# EAGLE schematic LautIO (EAGLE 9.6.2)

## Sheet 1 of 7
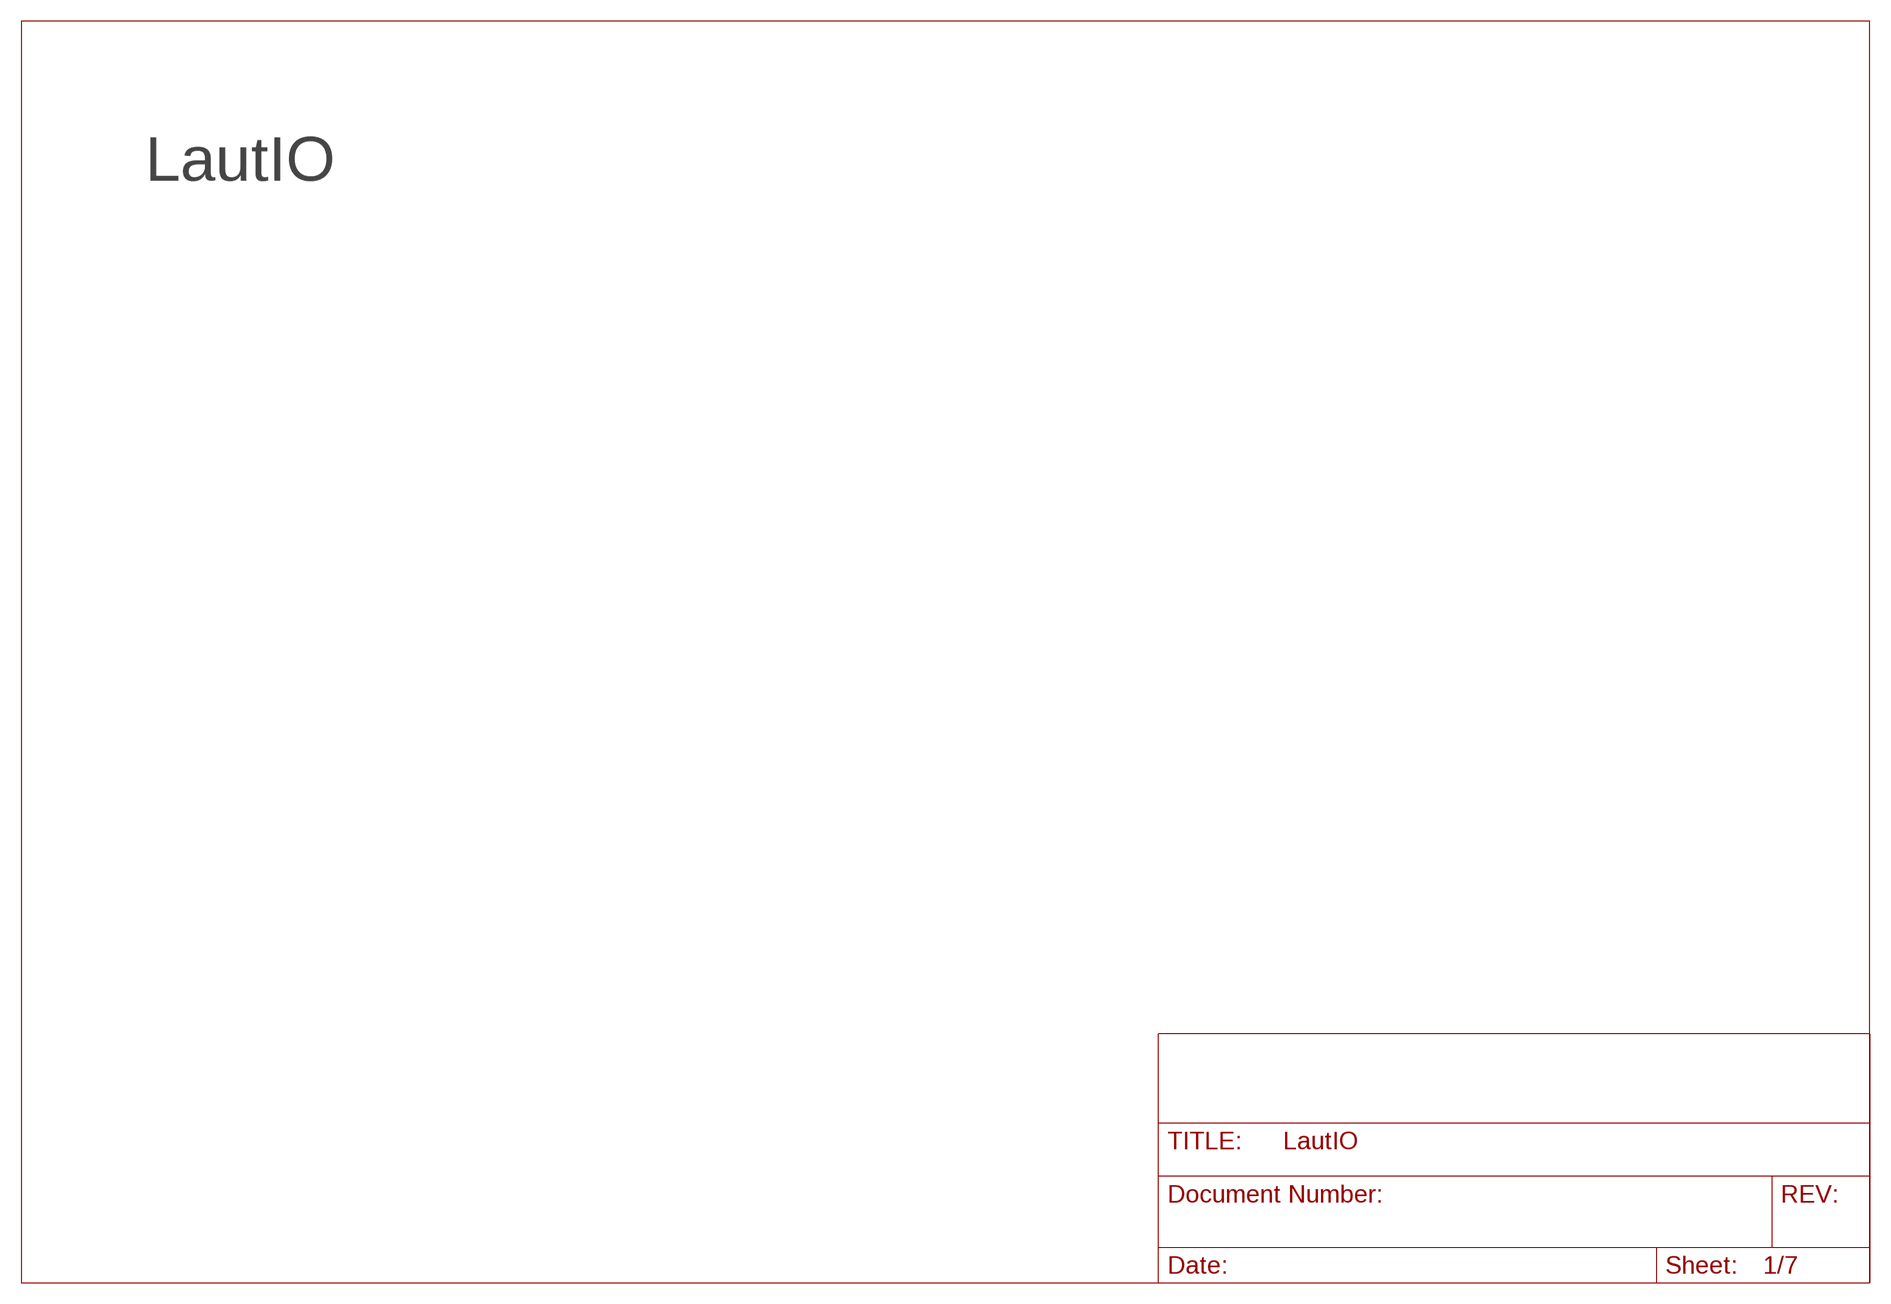
[diagram p0: schematic, sheet 1]

### Notes on the sheet
- LautIO

## Sheet 2 of 7
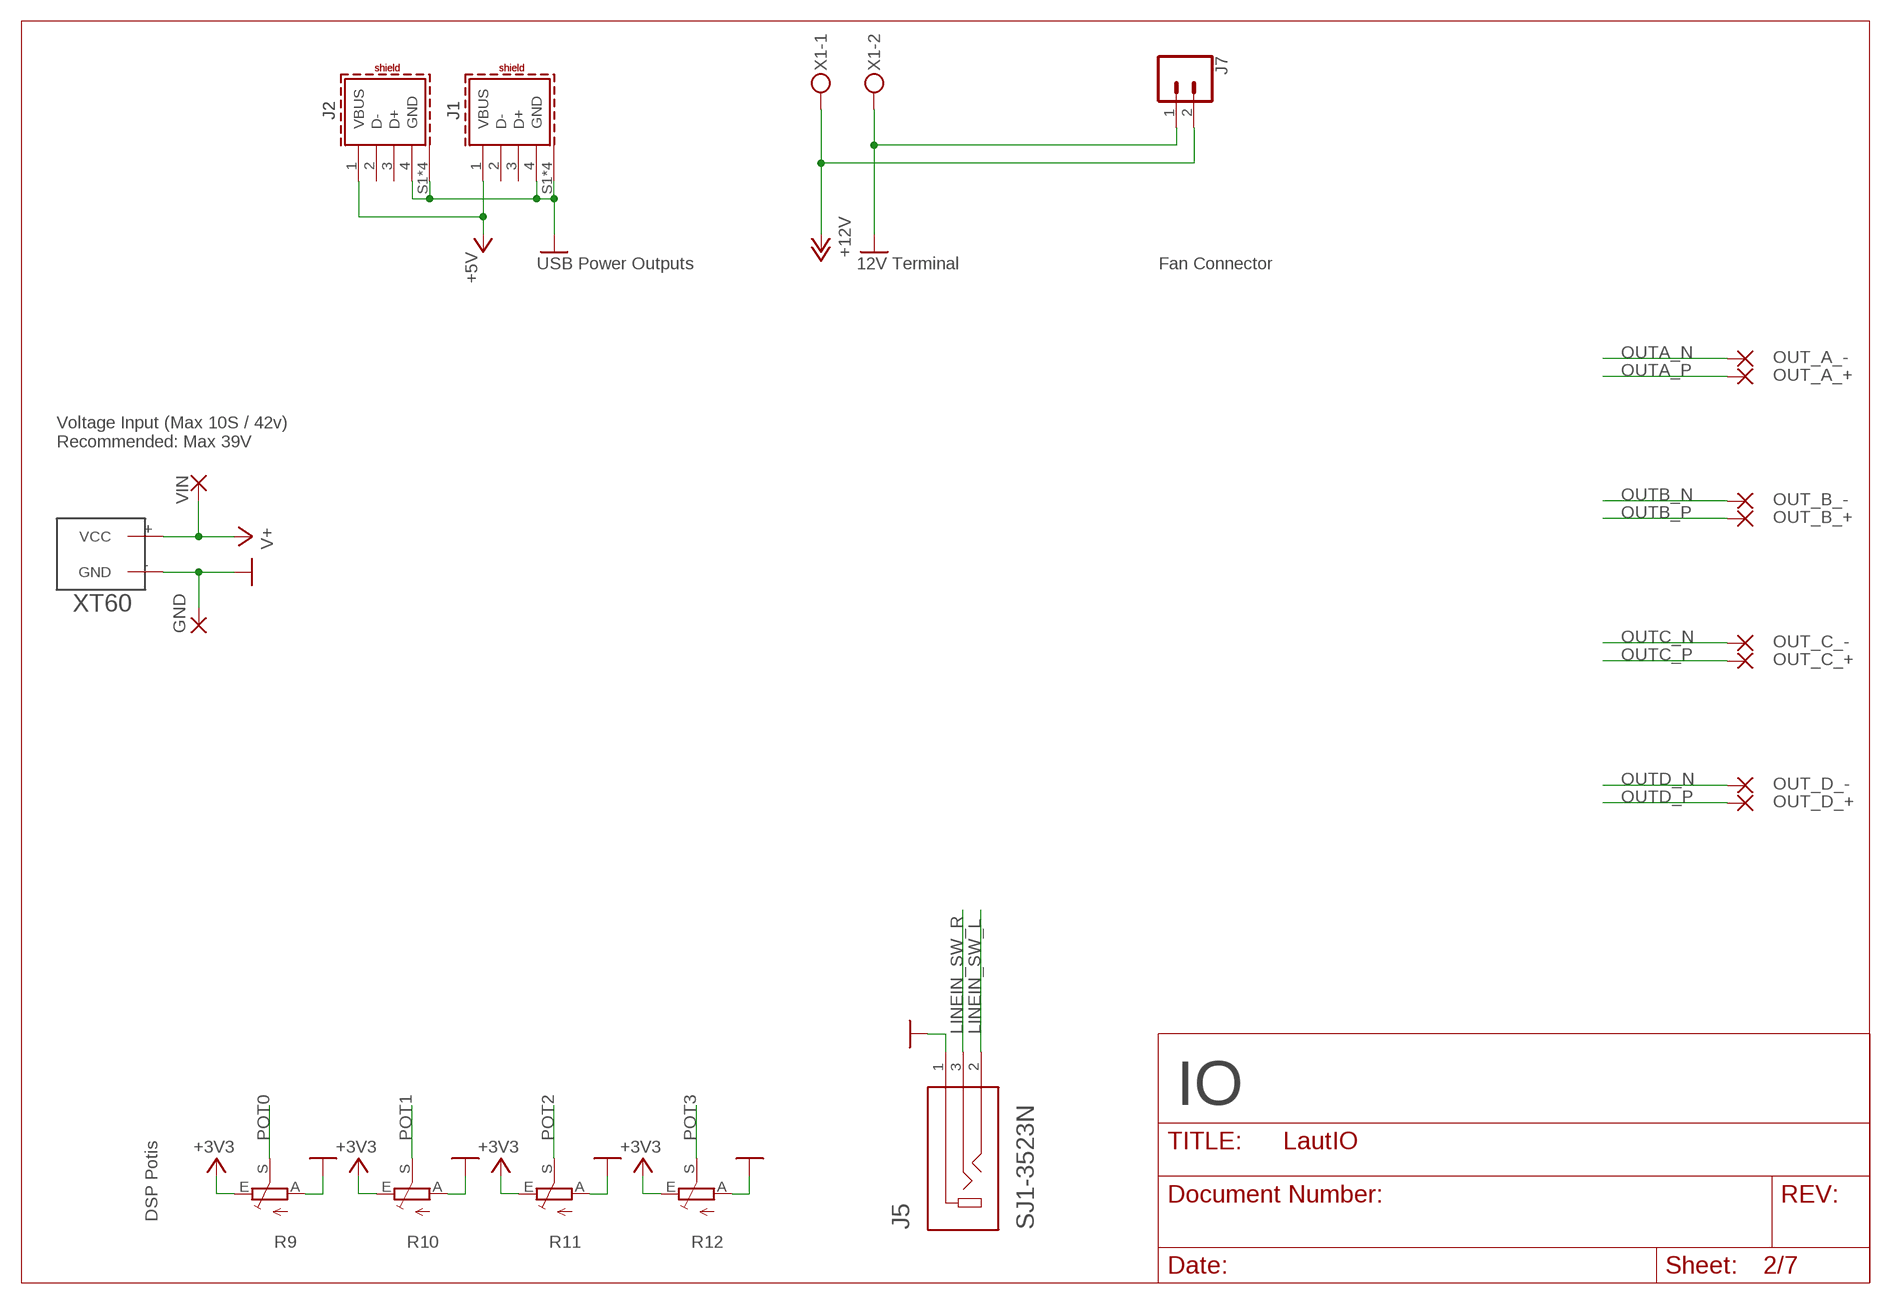
[diagram p1: schematic, sheet 2]

### Parts
GND  SMD5  [SMD2,54-5,08]
J1  614004134726  [614004134726]
J2  614004134726  [614004134726]
J5  SJ1-3523N  [CUI_SJ1-3523N]
J7  CONN_02  [1X02]
OUT_A_+  SMD2  [SMD1,27-2,54]
OUT_A_-  SMD2  [SMD1,27-2,54]
OUT_B_+  SMD2  [SMD1,27-2,54]
OUT_B_-  SMD2  [SMD1,27-2,54]
OUT_C_+  SMD2  [SMD1,27-2,54]
OUT_C_-  SMD2  [SMD1,27-2,54]
OUT_D_+  SMD2  [SMD1,27-2,54]
OUT_D_-  SMD2  [SMD1,27-2,54]
R9  TRIM_EU-CIP20C-6MM  [CIP20C-6MM]
R10  TRIM_EU-CIP20C-6MM  [CIP20C-6MM]
R11  TRIM_EU-CIP20C-6MM  [CIP20C-6MM]
R12  TRIM_EU-CIP20C-6MM  [CIP20C-6MM]
U$1  XT60  [XT60]
VIN  SMD5  [SMD2,54-5,08]
X1  MKDSN1,5/2-5,08  [MKDSN1,5/2-5,08]

### Nets
+3V3: R9.E R10.E R11.E R12.E ; also sheet 3,4,5,6,7
+5V: J1.1(VBUS) J2.1(VBUS) ; also sheet 3,4
+12V: J7.2 X1.1 ; also sheet 3
GND: GND.1(P) J1.4(GND) J1.S1(SHIELD) J1.S2(SHIELD) J1.S3(SHIELD) J1.S4(SHIELD) J2.4(GND) J2.S1(SHIELD) J2.S2(SHIELD) J2.S3(SHIELD) J2.S4(SHIELD) J5.1 J7.1 R9.A R10.A R11.A R12.A U$1.-(GND) X1.2 ; also sheet 3,4,5,6,7
LINEIN_SW_L: J5.2 ; also sheet 5
LINEIN_SW_R: J5.3 ; also sheet 5
OUTA_N: OUT_A_-.1(P) ; also sheet 6
OUTA_P: OUT_A_+.1(P) ; also sheet 6
OUTB_N: OUT_B_-.1(P) ; also sheet 6
OUTB_P: OUT_B_+.1(P) ; also sheet 6
OUTC_N: OUT_C_-.1(P) ; also sheet 7
OUTC_P: OUT_C_+.1(P) ; also sheet 7
OUTD_N: OUT_D_-.1(P) ; also sheet 7
OUTD_P: OUT_D_+.1(P) ; also sheet 7
POT0: R9.S ; also sheet 5
POT1: R10.S ; also sheet 5
POT2: R11.S ; also sheet 5
POT3: R12.S ; also sheet 5
V+: U$1.+(VCC) VIN.1(P) ; also sheet 3,6,7
Unconnected: J1.2(D-) J1.3(D+) J2.2(D-) J2.3(D+)

### Notes on the sheet
- USB Power Outputs | 12V Terminal | Fan Connector
- Voltage Input (Max 10S / 42v)
  Recommended: Max 39V
- IO
- DSP Potis

## Sheet 3 of 7
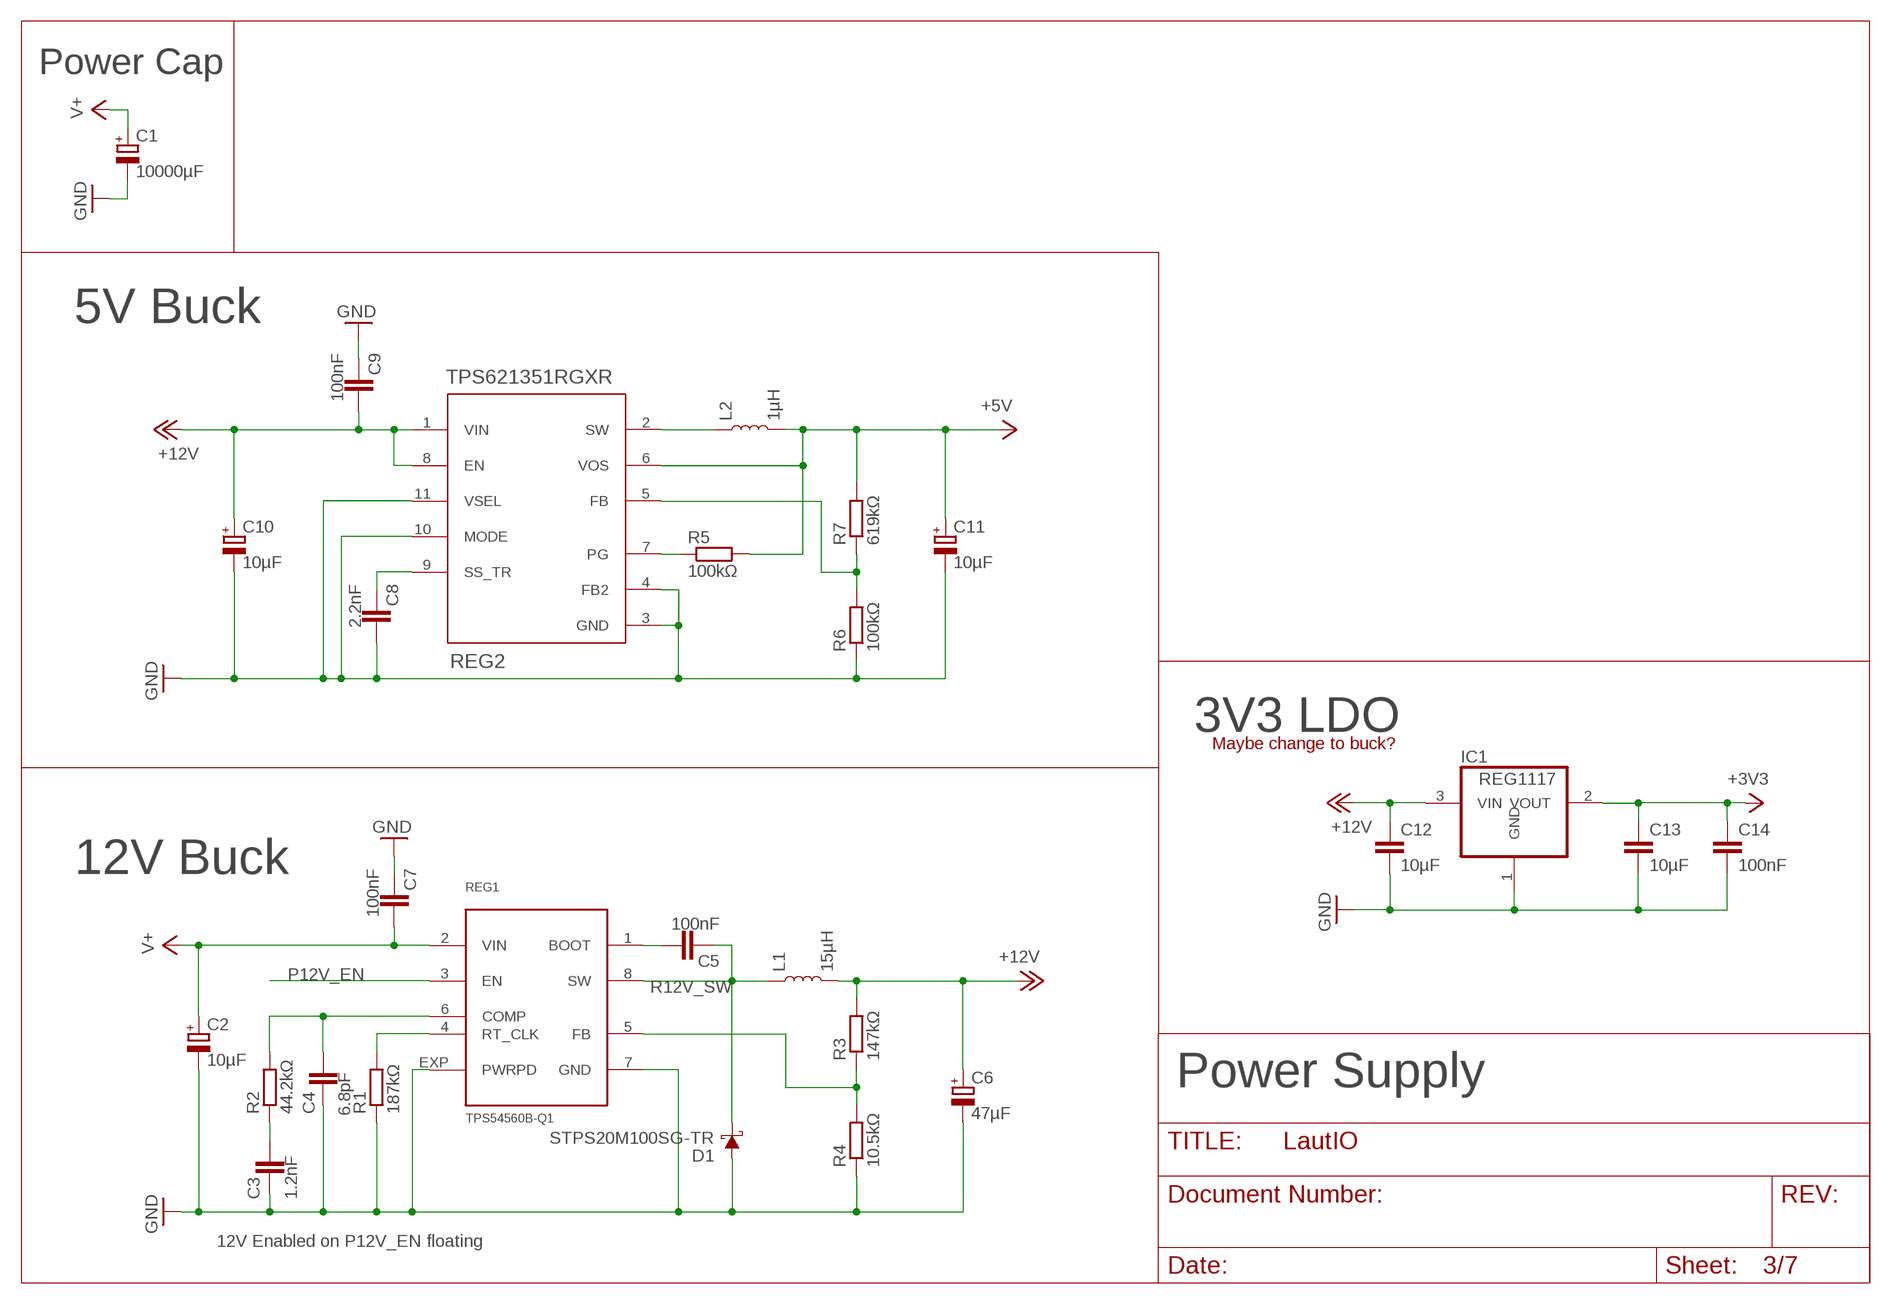
[diagram p2: schematic, sheet 3]

### Parts
C1  10000µF  CPOL-EUE10-35  [EB35D]
C2  10µF  CPOL-EU153CLV-0605  [153CLV-0605]
C3  1.2nF  C-EUC0603  [C0603]
C4  6.8pF  C-EUC0603  [C0603]
C5  100nF  C-EUC0603  [C0603]
C6  47µF  CPOL-EU153CLV-0807  [153CLV-0807]
C7  100nF  C-EUC0603  [C0603]
C8  2.2nF  C-EUC0603  [C0603]
C9  100nF  C-EUC0603  [C0603]
C10  10µF  CPOL-EU153CLV-0605  [153CLV-0605]
C11  10µF  CPOL-EU153CLV-0605  [153CLV-0605]
C12  10µF  C-EUC1206  [C1206]
C13  10µF  C-EUC1206  [C1206]
C14  100nF  C-EUC0603  [C0603]
D1  STPS20M100SG-TR  [TO-263/D2PAK]
IC1  REG1117  [SOT223]
L1  15µH  INDUCTOR-SDR13-27UH  [INDUCTOR_SDR1307]
L2  1µH  4.7μH_SHIELDED_INDUCTORNPIS_LS  [INDUCTOR_4X4MM]
R1  187kΩ  R-EU_R0603  [R0603]
R2  44.2kΩ  R-EU_R0603  [R0603]
R3  147kΩ  R-EU_R0603  [R0603]
R4  10.5kΩ  R-EU_R0603  [R0603]
R5  100kΩ  R-EU_R0603  [R0603]
R6  100kΩ  R-EU_R0603  [R0603]
R7  619kΩ  R-EU_R0603  [R0603]
REG1  TPS54560B-Q1  [HSOP8]
REG2  TPS621351RGXR  [RGX0011A]

### Nets
+3V3: C13.1 C14.1 IC1.2(VOUT) ; also sheet 2,4,5,6,7
+5V: C11.+ L2.P$2 R5.2 R7.2 REG2.6(VOS) ; also sheet 2,4
+12V: C6.+ C9.1 C10.+ C12.1 IC1.3(VIN) L1.P$2 R3.2 REG2.1(VIN) REG2.8(EN) ; also sheet 2
GND: C1.- C2.- C3.2 C4.2 C6.- C7.2 C8.1 C9.2 C10.- C11.- C12.2 C13.2 C14.2 D1.1(A) D1.3(A) IC1.1(GND) R1.1 R4.1 R6.1 REG1.7(GND) REG1.EXP(PWRPD) REG2.3(GND) REG2.4(FB2) REG2.10(MODE) REG2.11(VSEL) ; also sheet 2,4,5,6,7
N$1: R1.2 REG1.4(RT_CLK)
N$2: C4.1 R2.2 REG1.6(COMP)
N$3: C3.1 R2.1
N$4: C5.1 REG1.1(BOOT)
N$5: R6.2 R7.1 REG2.5(FB)
N$6: R3.1 R4.2 REG1.5(FB)
N$7: L2.P$1 REG2.2(SW)
N$8: R5.1 REG2.7(PG)
N$11: C8.2 REG2.9(SS_TR)
P12V_EN: REG1.3(EN)
R12V_SW: C5.2 D1.2(C) L1.P$1 REG1.8(SW)
V+: C1.+ C2.+ C7.1 REG1.2(VIN) ; also sheet 2,6,7

### Notes on the sheet
- Power Cap
- 5V Buck
- 3V3 LDO
- Maybe change to buck?
- 12V Buck
- Power Supply
- 12V Enabled on P12V_EN floating

## Sheet 4 of 7
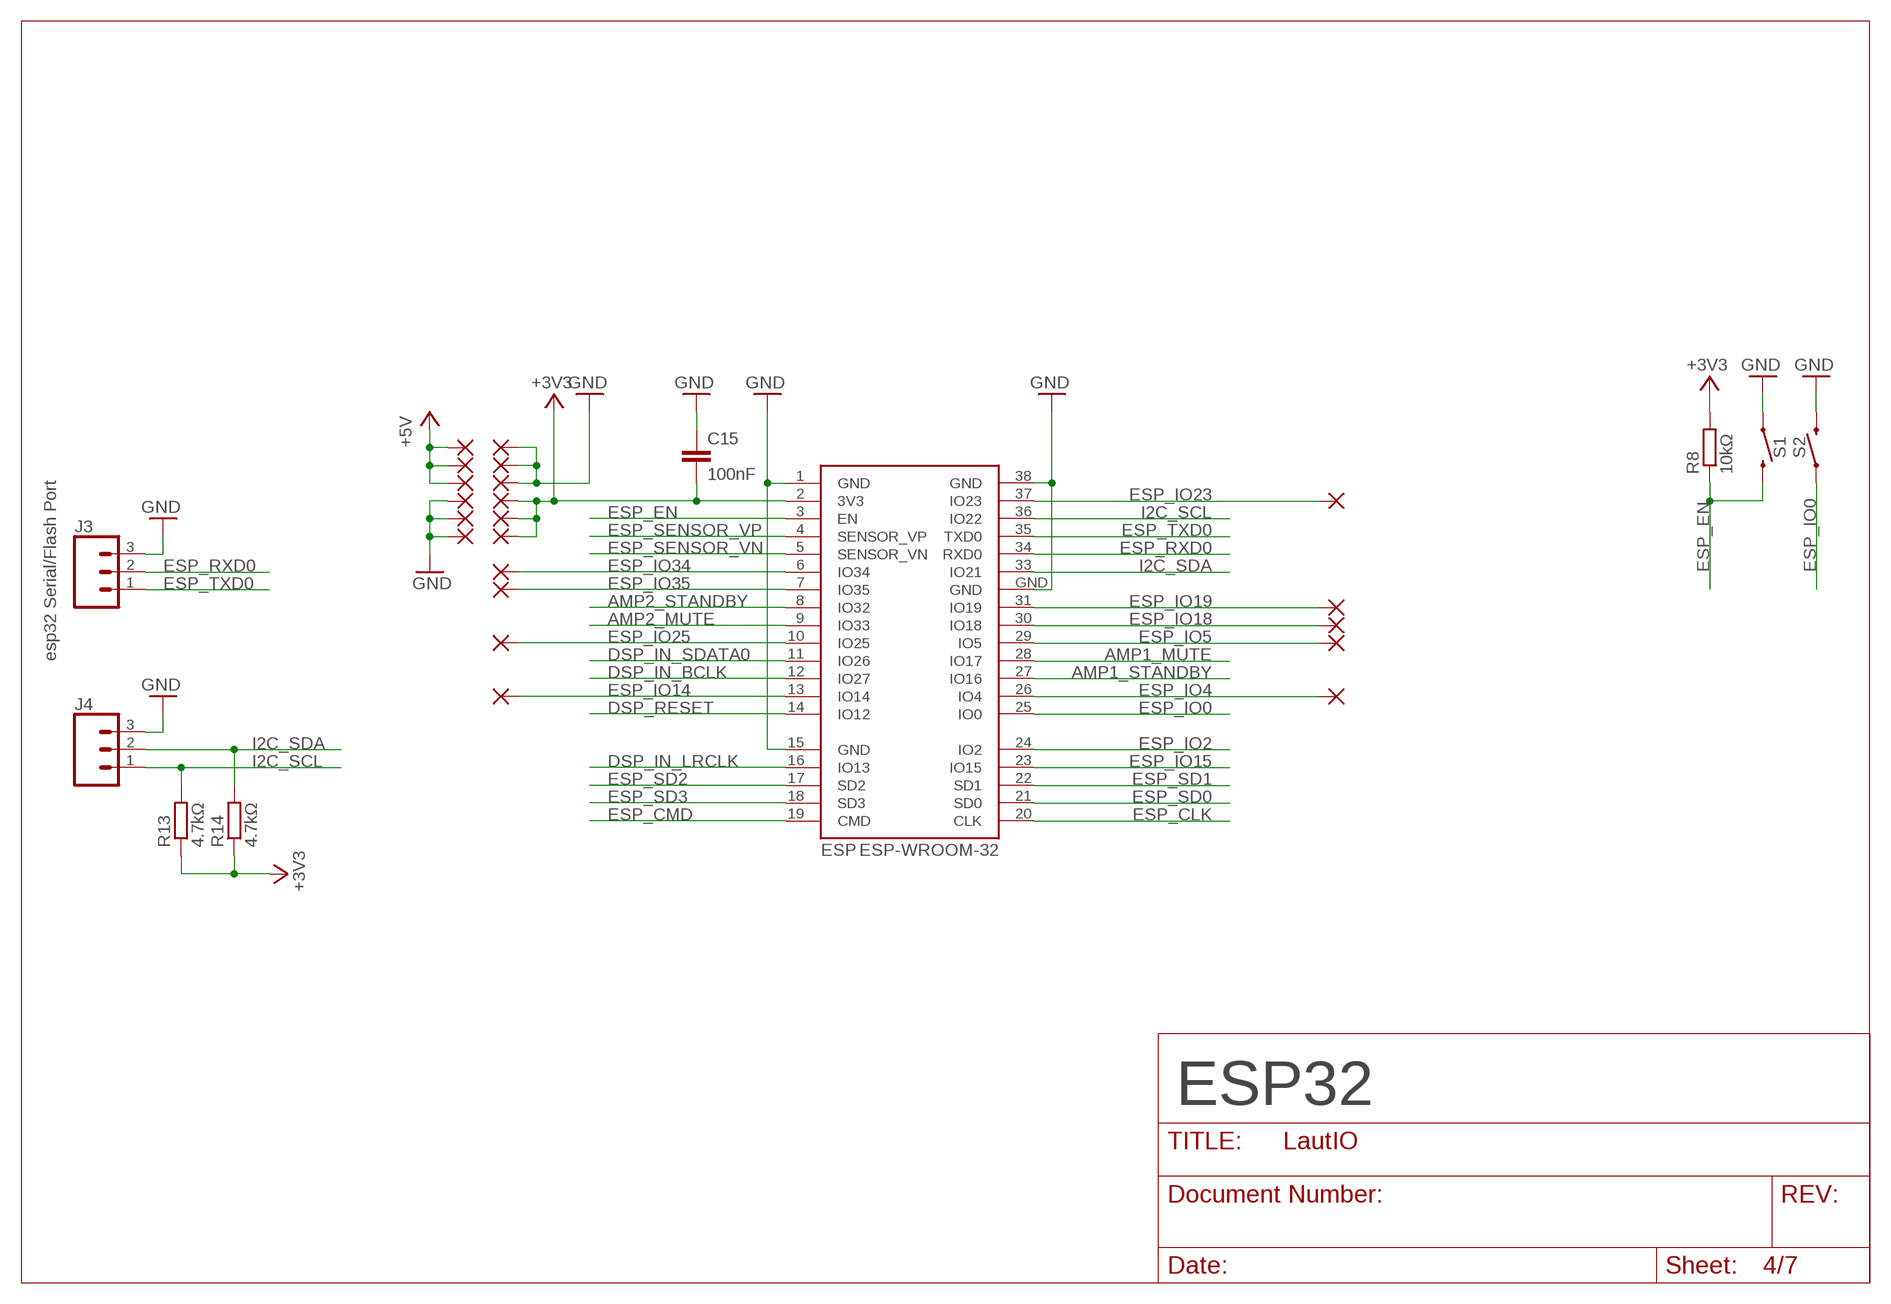
[diagram p3: schematic, sheet 4]

### Parts
C15  100nF  C-EUC0603  [C0603]
ESP  ESP-WROOM-32  [ESP-WROOM-32]
IO4  SMD2  [SMD1,27-2,54]
IO5  SMD2  [SMD1,27-2,54]
IO14  SMD2  [SMD1,27-2,54]
IO18  SMD2  [SMD1,27-2,54]
IO19  SMD2  [SMD1,27-2,54]
IO23  SMD2  [SMD1,27-2,54]
IO25  SMD2  [SMD1,27-2,54]
IO34  SMD2  [SMD1,27-2,54]
IO35  SMD2  [SMD1,27-2,54]
J3  455-1750-1-ND  CONN_03  [1X03]
J4  455-1750-1-ND  CONN_03  [1X03]
PAD1  SMD2  [SMD1,27-2,54]
PAD2  SMD2  [SMD1,27-2,54]
PAD3  SMD2  [SMD1,27-2,54]
PAD4  SMD2  [SMD1,27-2,54]
PAD5  SMD2  [SMD1,27-2,54]
PAD6  SMD2  [SMD1,27-2,54]
PAD7  SMD2  [SMD1,27-2,54]
PAD8  SMD2  [SMD1,27-2,54]
PAD9  SMD2  [SMD1,27-2,54]
PAD10  SMD2  [SMD1,27-2,54]
PAD11  SMD2  [SMD1,27-2,54]
PAD12  SMD2  [SMD1,27-2,54]
R8  10kΩ  R-EU_R0603  [R0603]
R13  4.7kΩ  R-EU_R0603  [R0603]
R14  4.7kΩ  R-EU_R0603  [R0603]
S1  MOMENTARY-SWITCH-SPST-SMD-6.2MM-TALL  [TACTILE_SWITCH_SMD_6.2MM_TALL]
S2  MOMENTARY-SWITCH-SPST-SMD-6.2MM-TALL  [TACTILE_SWITCH_SMD_6.2MM_TALL]

### Nets
+3V3: C15.2 ESP.2(3V3) PAD2.1(P) PAD4.1(P) PAD10.1(P) R8.2 R13.1 R14.1 ; also sheet 2,3,5,6,7
+5V: PAD5.1(P) PAD6.1(P) PAD7.1(P) ; also sheet 2,3
AMP1_MUTE: ESP.28(IO17) ; also sheet 6
AMP1_STANDBY: ESP.27(IO16) ; also sheet 6
AMP2_MUTE: ESP.9(IO33) ; also sheet 7
AMP2_STANDBY: ESP.8(IO32) ; also sheet 7
DSP_IN_BCLK: ESP.12(IO27) ; also sheet 5
DSP_IN_LRCLK: ESP.16(IO13) ; also sheet 5
DSP_IN_SDATA0: ESP.11(IO26) ; also sheet 5
DSP_RESET: ESP.14(IO12) ; also sheet 5
ESP_CLK: ESP.20(CLK)
ESP_CMD: ESP.19(CMD)
ESP_EN: ESP.3(EN) R8.1 S1.B2
ESP_IO0: ESP.25(IO0) S2.A2
ESP_IO2: ESP.24(IO2)
ESP_IO4: ESP.26(IO4) IO4.1(P)
ESP_IO5: ESP.29(IO5) IO5.1(P)
ESP_IO14: ESP.13(IO14) IO14.1(P)
ESP_IO15: ESP.23(IO15)
ESP_IO18: ESP.30(IO18) IO18.1(P)
ESP_IO19: ESP.31(IO19) IO19.1(P)
ESP_IO23: ESP.37(IO23) IO23.1(P)
ESP_IO25: ESP.10(IO25) IO25.1(P)
ESP_IO34: ESP.6(IO34) IO34.1(P)
ESP_IO35: ESP.7(IO35) IO35.1(P)
ESP_RXD0: ESP.34(RXD0) J3.2
ESP_SD0: ESP.21(SD0)
ESP_SD1: ESP.22(SD1)
ESP_SD2: ESP.17(SD2)
ESP_SD3: ESP.18(SD3)
ESP_SENSOR_VN: ESP.5(SENSOR_VN)
ESP_SENSOR_VP: ESP.4(SENSOR_VP)
ESP_TXD0: ESP.35(TXD0) J3.1
GND: C15.1 ESP.1(GND) ESP.15(GND) ESP.38(GND) ESP.GND J3.3 J4.3 PAD1.1(P) PAD3.1(P) PAD8.1(P) PAD9.1(P) PAD11.1(P) PAD12.1(P) S1.A2 S2.B2 ; also sheet 2,3,5,6,7
I2C_SCL: ESP.36(IO22) J4.1 R13.2 ; also sheet 5
I2C_SDA: ESP.33(IO21) J4.2 R14.2 ; also sheet 5

### Notes on the sheet
- esp32 Serial/Flash Port
- ESP32

## Sheet 5 of 7
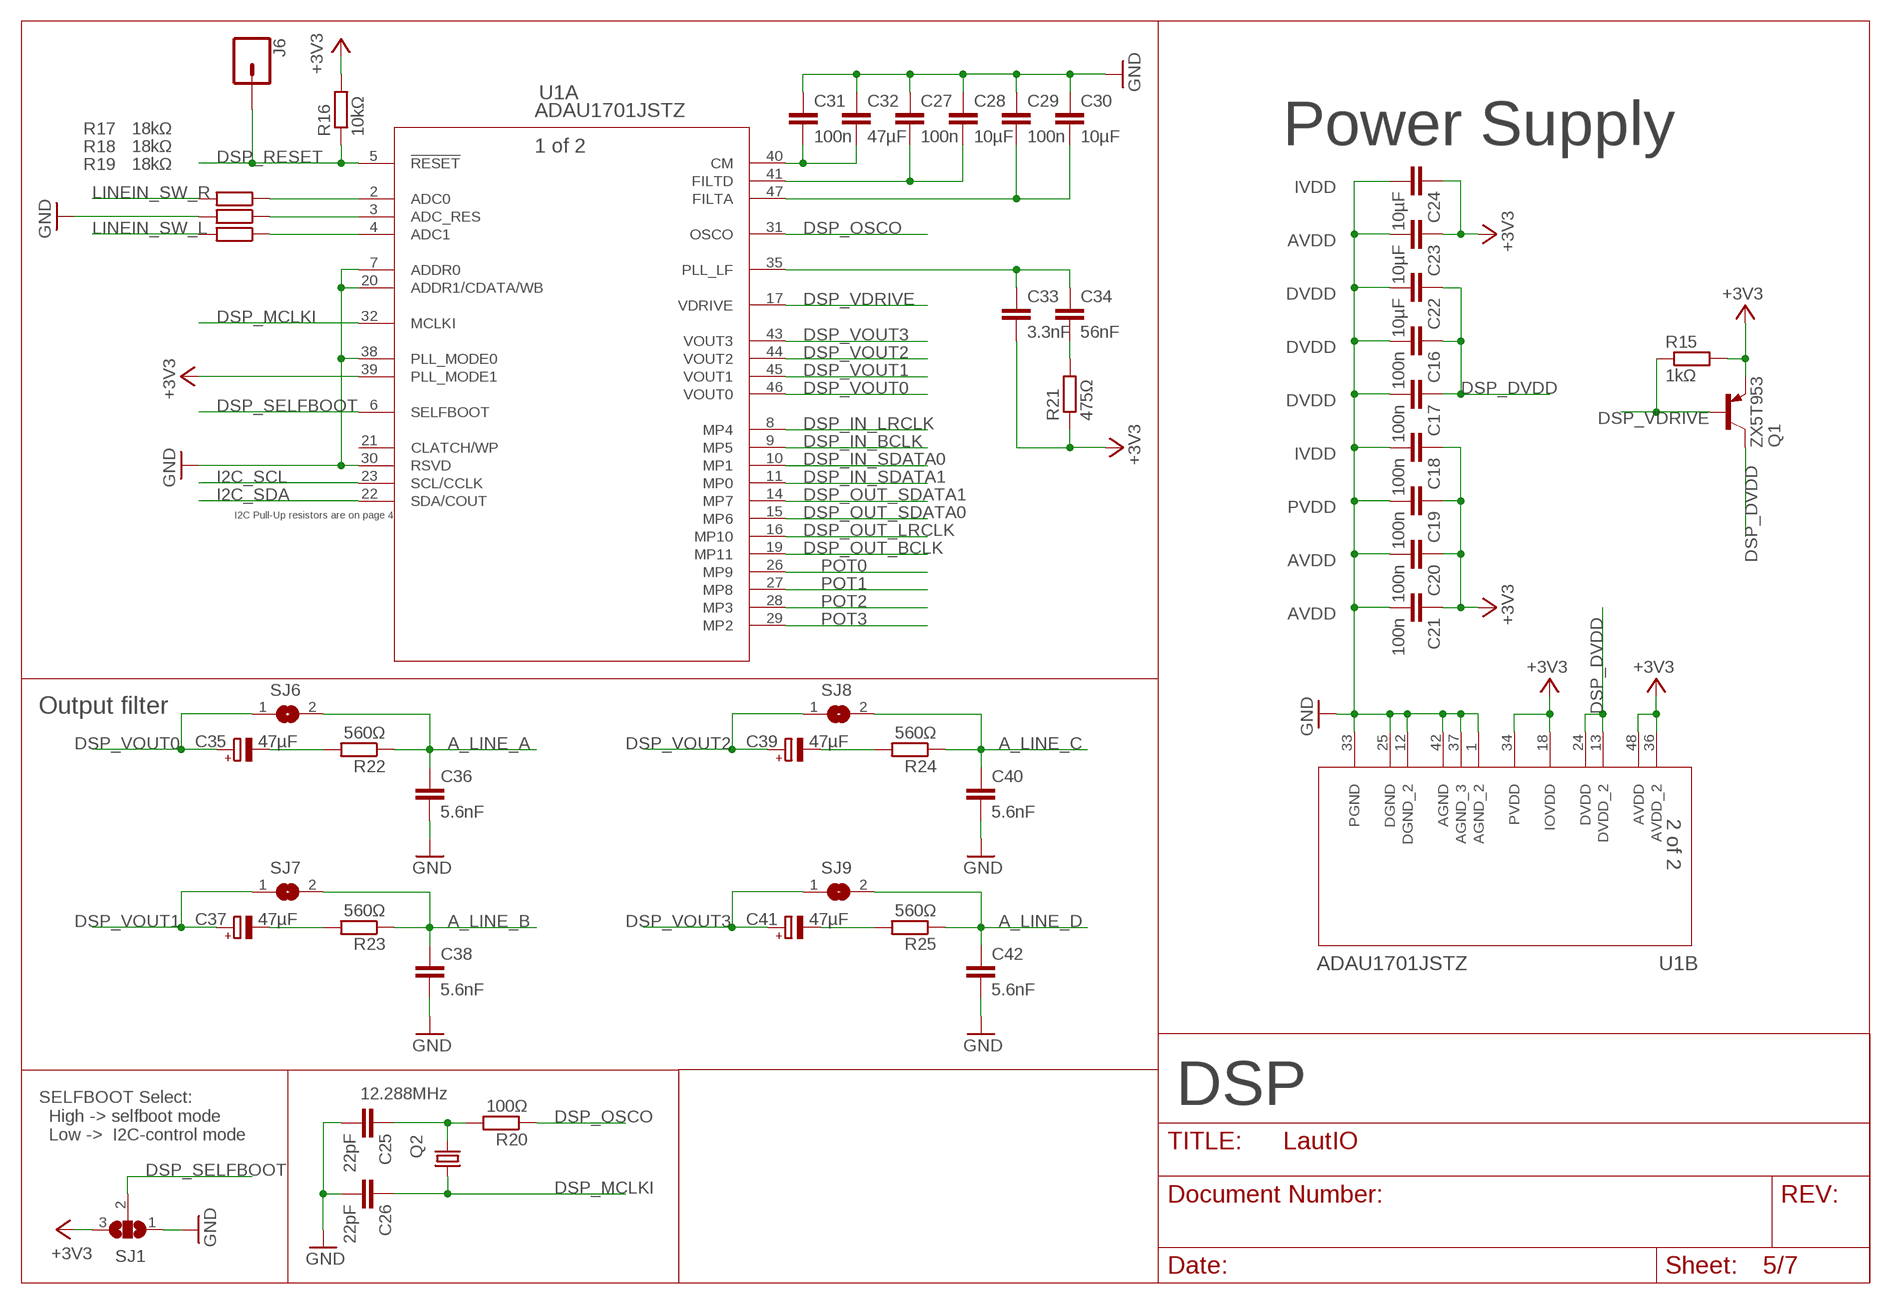
[diagram p4: schematic, sheet 5]

### Parts
C16  100n  C-EUC0603  [C0603]
C17  100n  C-EUC0603  [C0603]
C18  100n  C-EUC0603  [C0603]
C19  100n  C-EUC0603  [C0603]
C20  100n  C-EUC0603  [C0603]
C21  100n  C-EUC0603  [C0603]
C22  10µF  C-EUC1206K  [C1206K]
C23  10µF  C-EUC1206K  [C1206K]
C24  10µF  C-EUC1206K  [C1206K]
C25  22pF  C-EUC0603  [C0603]
C26  22pF  C-EUC0603  [C0603]
C27  100n  C-EUC0603  [C0603]
C28  10µF  C-EUC1206K  [C1206K]
C29  100n  C-EUC0603  [C0603]
C30  10µF  C-EUC1206K  [C1206K]
C31  100n  C-EUC0603  [C0603]
C32  47µF  C-EUC1206K  [C1206K]
C33  3.3nF  C-EUC0603  [C0603]
C34  56nF  C-EUC0603  [C0603]
C35  47µF  CPOL-EU153CLV-0605  [153CLV-0605]
C36  5.6nF  C-EUC0603  [C0603]
C37  47µF  CPOL-EU153CLV-0605  [153CLV-0605]
C38  5.6nF  C-EUC0603  [C0603]
C39  47µF  CPOL-EU153CLV-0605  [153CLV-0605]
C40  5.6nF  C-EUC0603  [C0603]
C41  47µF  CPOL-EU153CLV-0605  [153CLV-0605]
C42  5.6nF  C-EUC0603  [C0603]
J6  CONN_01  [1X01]
Q1  ZX5T953  FZT753SMD  [SOT223]
Q2  12.288MHz  CSM-7X-DU  [CSM-7X-DU]
R15  1kΩ  R-EU_R0603  [R0603]
R16  10kΩ  R-EU_R0603  [R0603]
R17  18kΩ  R-EU_R0603  [R0603]
R18  18kΩ  R-EU_R0603  [R0603]
R19  18kΩ  R-EU_R0603  [R0603]
R20  100Ω  R-EU_R0603  [R0603]
R21  475Ω  R-EU_R0603  [R0603]
R22  560Ω  R-EU_R0603  [R0603]
R23  560Ω  R-EU_R0603  [R0603]
R24  560Ω  R-EU_R0603  [R0603]
R25  560Ω  R-EU_R0603  [R0603]
SJ1  SJ2W  [SJ_2]
SJ6  SJ  [SJ]
SJ7  SJ  [SJ]
SJ8  SJ  [SJ]
SJ9  SJ  [SJ]
U1  ADAU1701JSTZ  [ST_48_ADI]

### Nets
+3V3: C18.1 C19.1 C20.1 C21.1 C23.1 C24.1 C33.2 Q1.3(E) R15.2 R16.2 R21.1 SJ1.3 U1.18(B:IOVDD) U1.34(B:PVDD) U1.36(B:AVDD_2) U1.39(A:PLL_MODE1) U1.48(B:AVDD) ; also sheet 2,3,4,6,7
A_LINE_A: C36.1 R22.1 SJ6.2 ; also sheet 6
A_LINE_B: C38.1 R23.1 SJ7.2 ; also sheet 6
A_LINE_C: C40.1 R24.1 SJ8.2 ; also sheet 7
A_LINE_D: C42.1 R25.1 SJ9.2 ; also sheet 7
DSP_DVDD: C16.1 C17.1 C22.1 Q1.2(C) Q1.4(C) U1.13(B:DVDD_2) U1.24(B:DVDD)
DSP_IN_BCLK: U1.9(A:MP5) ; also sheet 4
DSP_IN_LRCLK: U1.8(A:MP4) ; also sheet 4
DSP_IN_SDATA0: U1.10(A:MP1) ; also sheet 4
DSP_IN_SDATA1: U1.11(A:MP0)
DSP_MCLKI: C26.1 Q2.1 U1.32(A:MCLKI)
DSP_OSCO: R20.1 U1.31(A:OSCO)
DSP_OUT_BCLK: U1.19(A:MP11)
DSP_OUT_LRCLK: U1.16(A:MP10)
DSP_OUT_SDATA0: U1.15(A:MP6)
DSP_OUT_SDATA1: U1.14(A:MP7)
DSP_RESET: J6.1 R16.1 U1.5(A:!RESET) ; also sheet 4
DSP_SELFBOOT: SJ1.2 U1.6(A:SELFBOOT)
DSP_VDRIVE: Q1.1(B) R15.1 U1.17(A:VDRIVE)
DSP_VOUT0: C35.+ SJ6.1 U1.46(A:VOUT0)
DSP_VOUT1: C37.+ SJ7.1 U1.45(A:VOUT1)
DSP_VOUT2: C39.+ SJ8.1 U1.44(A:VOUT2)
DSP_VOUT3: C41.+ SJ9.1 U1.43(A:VOUT3)
GND: C16.2 C17.2 C18.2 C19.2 C20.2 C21.2 C22.2 C23.2 C24.2 C25.2 C26.2 C27.1 C28.1 C29.1 C30.1 C31.1 C32.1 C36.2 C38.2 C40.2 C42.2 R18.2 SJ1.1 U1.1(B:AGND_2) U1.7(A:ADDR0) U1.12(B:DGND_2) U1.20(A:ADDR1/CDATA/WB) U1.25(B:DGND) U1.30(A:RSVD) U1.33(B:PGND) U1.37(B:AGND_3) U1.38(A:PLL_MODE0) U1.42(B:AGND) ; also sheet 2,3,4,6,7
I2C_SCL: U1.23(A:SCL/CCLK) ; also sheet 4
I2C_SDA: U1.22(A:SDA/COUT) ; also sheet 4
LINEIN_SW_L: R19.2 ; also sheet 2
LINEIN_SW_R: R17.2 ; also sheet 2
N$9: R17.1 U1.2(A:ADC0)
N$10: R18.1 U1.3(A:ADC_RES)
N$12: R19.1 U1.4(A:ADC1)
N$13: C25.1 Q2.2 R20.2
N$14: C27.2 C28.2 U1.41(A:FILTD)
N$15: C31.2 C32.2 U1.40(A:CM)
N$16: C29.2 C30.2 U1.47(A:FILTA)
N$17: C33.1 C34.1 U1.35(A:PLL_LF)
N$18: C34.2 R21.2
N$19: C35.- R22.2
N$20: C37.- R23.2
N$23: C39.- R24.2
N$26: C41.- R25.2
POT0: U1.26(A:MP9) ; also sheet 2
POT1: U1.27(A:MP8) ; also sheet 2
POT2: U1.28(A:MP3) ; also sheet 2
POT3: U1.29(A:MP2) ; also sheet 2
Unconnected: U1.21(A:CLATCH/WP)

### Notes on the sheet
- Power Supply
- IVDD
- AVDD
- DVDD
- DVDD
- DVDD
- IVDD
- PVDD
- I2C Pull-Up resistors are on page 4
- AVDD
- AVDD
- Output filter
- DSP
- SELFBOOT Select:
    High -> selfboot mode
    Low ->  I2C-control mode

## Sheet 6 of 7
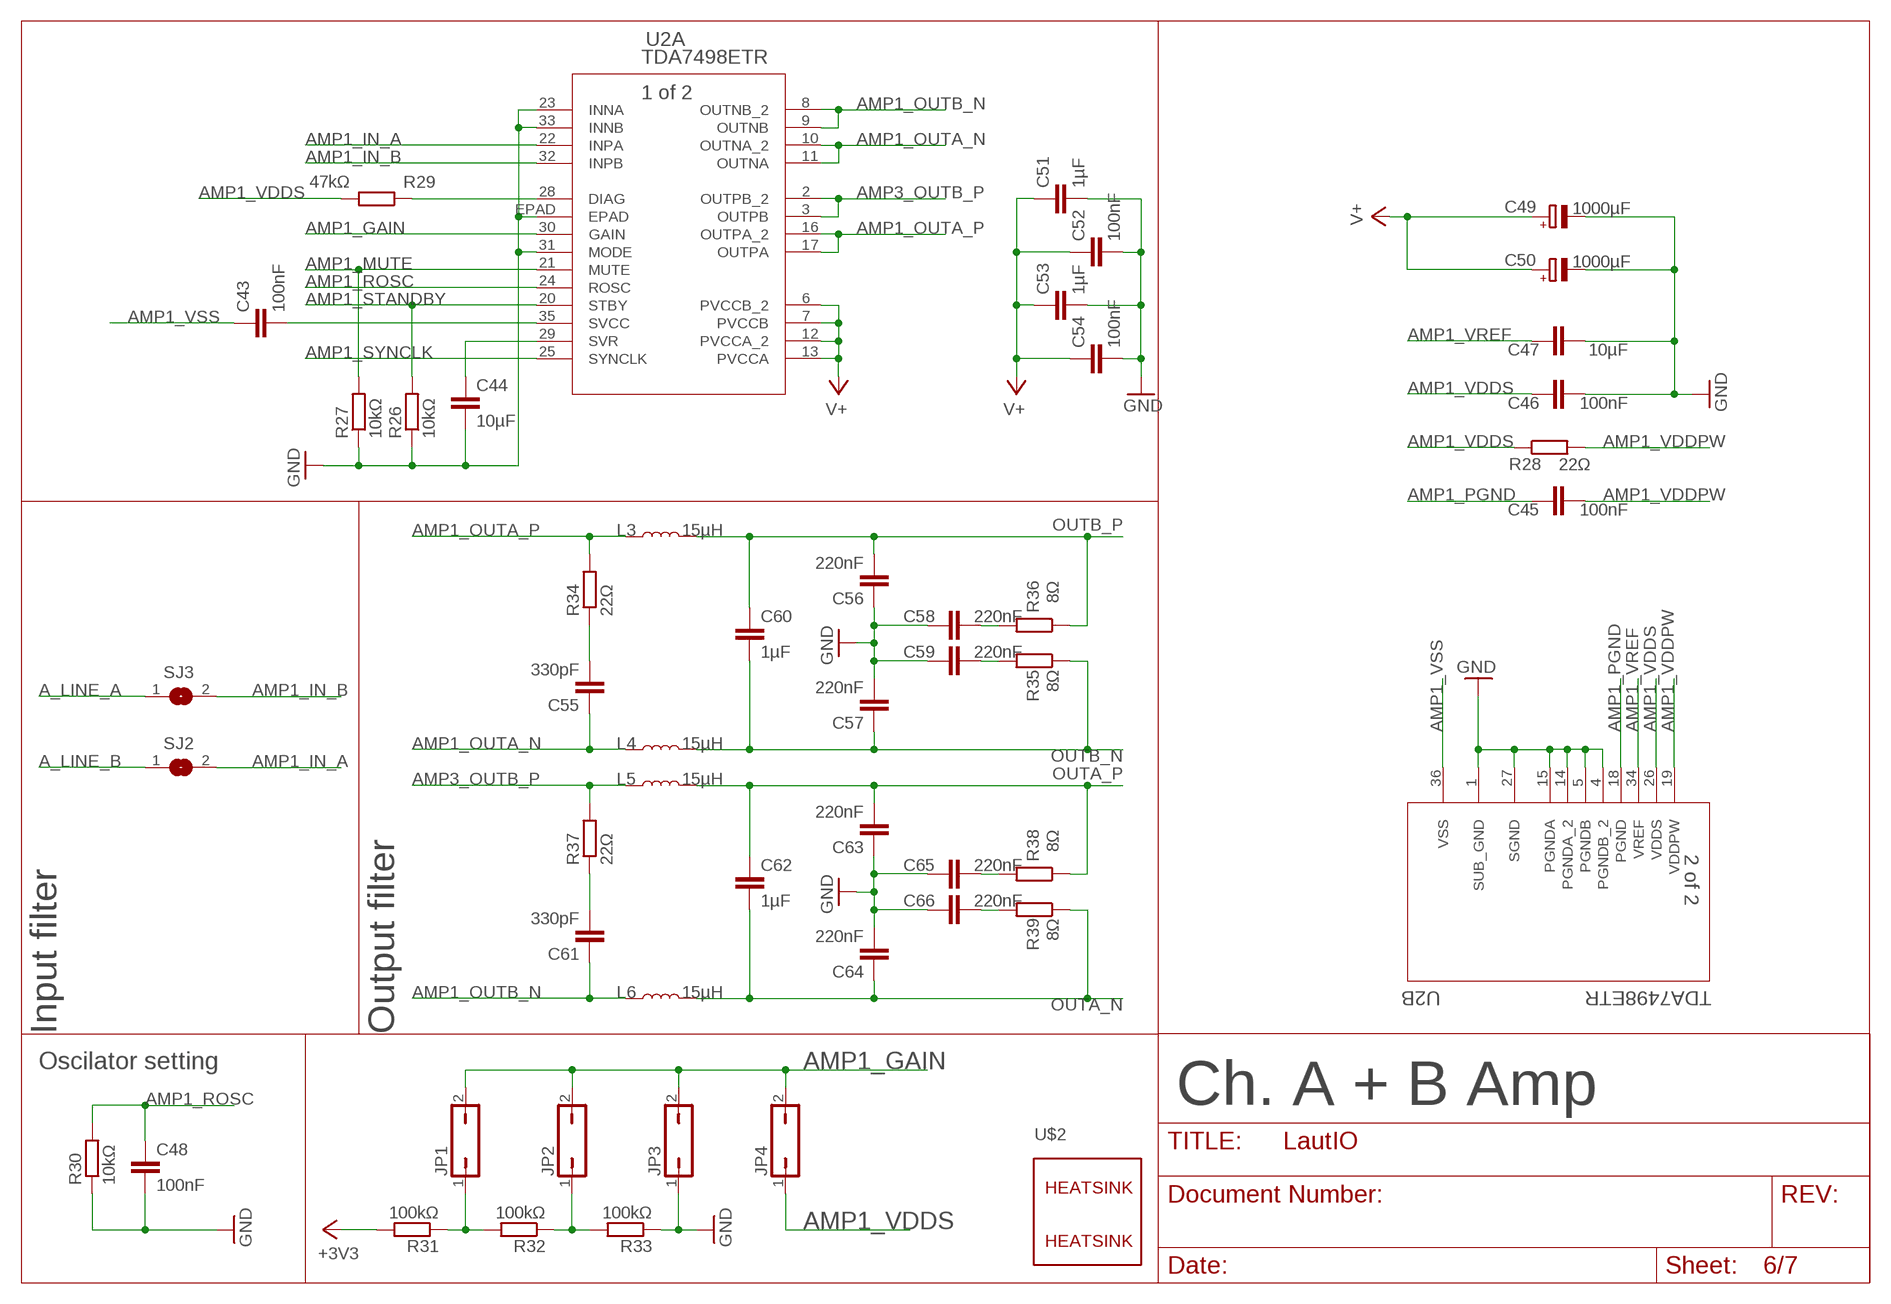
[diagram p5: schematic, sheet 6]

### Parts
C43  100nF  C-EUC0603  [C0603]
C44  10µF  C-EUC1206K  [C1206K]
C45  100nF  C-EUC0603  [C0603]
C46  100nF  C-EUC0603  [C0603]
C47  10µF  C-EUC1206K  [C1206K]
C48  100nF  C-EUC0603  [C0603]
C49  1000µF  CPOL-EUE7.5-16  [E7,5-16]
C50  1000µF  CPOL-EUE7.5-16  [E7,5-16]
C51  1µF  C-EUC0603  [C0603]
C52  100nF  C-EUC0603  [C0603]
C53  1µF  C-EUC0603  [C0603]
C54  100nF  C-EUC0603  [C0603]
C55  330pF  C-EUC0603  [C0603]
C56  220nF  C-EUC0603  [C0603]
C57  220nF  C-EUC0603  [C0603]
C58  220nF  C-EUC0603  [C0603]
C59  220nF  C-EUC0603  [C0603]
C60  1µF  C-EUC3640  [C3640]
C61  330pF  C-EUC0603  [C0603]
C62  1µF  C-EUC3640  [C3640]
C63  220nF  C-EUC0603  [C0603]
C64  220nF  C-EUC0603  [C0603]
C65  220nF  C-EUC0603  [C0603]
C66  220nF  C-EUC0603  [C0603]
JP1  JP1Q  [JP1]
JP2  JP1Q  [JP1]
JP3  JP1Q  [JP1]
JP4  JP1Q  [JP1]
L3  15µH  INDUCTOR-SDR13-27UH  [INDUCTOR_SDR1307]
L4  15µH  INDUCTOR-SDR13-27UH  [INDUCTOR_SDR1307]
L5  15µH  INDUCTOR-SDR13-27UH  [INDUCTOR_SDR1307]
L6  15µH  INDUCTOR-SDR13-27UH  [INDUCTOR_SDR1307]
R26  10kΩ  R-EU_R0603  [R0603]
R27  10kΩ  R-EU_R0603  [R0603]
R28  22Ω  R-EU_R0603  [R0603]
R29  47kΩ  R-EU_R0603  [R0603]
R30  10kΩ  R-EU_R0603  [R0603]
R31  100kΩ  R-EU_R0603  [R0603]
R32  100kΩ  R-EU_R0603  [R0603]
R33  100kΩ  R-EU_R0603  [R0603]
R34  22Ω  R-EU_R0603  [R0603]
R35  8Ω  R-EU_R0603  [R0603]
R36  8Ω  R-EU_R0603  [R0603]
R37  22Ω  R-EU_R0603  [R0603]
R38  8Ω  R-EU_R0603  [R0603]
R39  8Ω  R-EU_R0603  [R0603]
SJ2  SJ  [SJ]
SJ3  SJ  [SJ]
U2  TDA7498ETR  [SSO36_TDA7498ETR_STM]
U$2  ATS-CPX030030030  [ATS-CPX030030030]

### Nets
+3V3: R31.2 ; also sheet 2,3,4,5,7
A_LINE_A: SJ3.1 ; also sheet 5
A_LINE_B: SJ2.1 ; also sheet 5
AMP1_GAIN: JP1.2 JP2.2 JP3.2 JP4.2 U2.30(A:GAIN)
AMP1_IN_A: SJ2.2 U2.22(A:INPA)
AMP1_IN_B: SJ3.2 U2.32(A:INPB)
AMP1_MUTE: R27.2 U2.21(A:MUTE) ; also sheet 4
AMP1_OUTA_N: C55.1 L4.P$1 U2.10(A:OUTNA_2) U2.11(A:OUTNA)
AMP1_OUTA_P: L3.P$1 R34.2 U2.16(A:OUTPA_2) U2.17(A:OUTPA)
AMP1_OUTB_N: C61.1 L6.P$1 U2.8(A:OUTNB_2) U2.9(A:OUTNB)
AMP1_PGND: C45.1 U2.18(B:PGND)
AMP1_ROSC: C48.2 R30.2 U2.24(A:ROSC)
AMP1_STANDBY: R26.2 U2.20(A:STBY) ; also sheet 4
AMP1_SYNCLK: U2.25(A:SYNCLK)
AMP1_VDDPW: C45.2 R28.2 U2.19(B:VDDPW)
AMP1_VDDS: C46.1 JP4.1 R28.1 R29.2 U2.26(B:VDDS)
AMP1_VREF: C47.1 U2.34(B:VREF)
AMP1_VSS: C43.1 U2.36(B:VSS)
AMP3_OUTB_P: L5.P$1 R37.2 U2.2(A:OUTPB_2) U2.3(A:OUTPB)
GND: C44.2 C46.2 C47.2 C48.1 C49.- C50.- C51.2 C52.2 C53.2 C54.2 C56.1 C57.2 C58.2 C59.2 C63.1 C64.2 C65.2 C66.2 JP3.1 R26.1 R27.1 R30.1 R33.1 U2.1(B:SUB_GND) U2.4(B:PGNDB_2) U2.5(B:PGNDB) U2.14(B:PGNDA_2) U2.15(B:PGNDA) U2.23(A:INNA) U2.27(B:SGND) U2.31(A:MODE) U2.33(A:INNB) U2.EPAD(A:EPAD) ; also sheet 2,3,4,5,7
N$21: C43.2 U2.35(A:SVCC)
N$22: C44.1 U2.29(A:SVR)
N$24: R29.1 U2.28(A:DIAG)
N$25: JP1.1 R31.1 R32.2
N$27: JP2.1 R32.1 R33.2
N$28: C55.2 R34.1
N$29: C59.1 R35.2
N$30: C58.1 R36.2
N$31: C61.2 R37.1
N$32: C65.1 R38.2
N$33: C66.1 R39.2
OUTA_N: C62.2 C64.1 L6.P$2 R39.1 ; also sheet 2
OUTA_P: C62.1 C63.2 L5.P$2 R38.1 ; also sheet 2
OUTB_N: C57.1 C60.2 L4.P$2 R35.1 ; also sheet 2
OUTB_P: C56.2 C60.1 L3.P$2 R36.1 ; also sheet 2
V+: C49.+ C50.+ C51.1 C52.1 C53.1 C54.1 U2.6(A:PVCCB_2) U2.7(A:PVCCB) U2.12(A:PVCCA_2) U2.13(A:PVCCA) ; also sheet 2,3,7

### Notes on the sheet
- Input filter | Output filter
- Oscilator setting
- Ch. A + B Amp

## Sheet 7 of 7
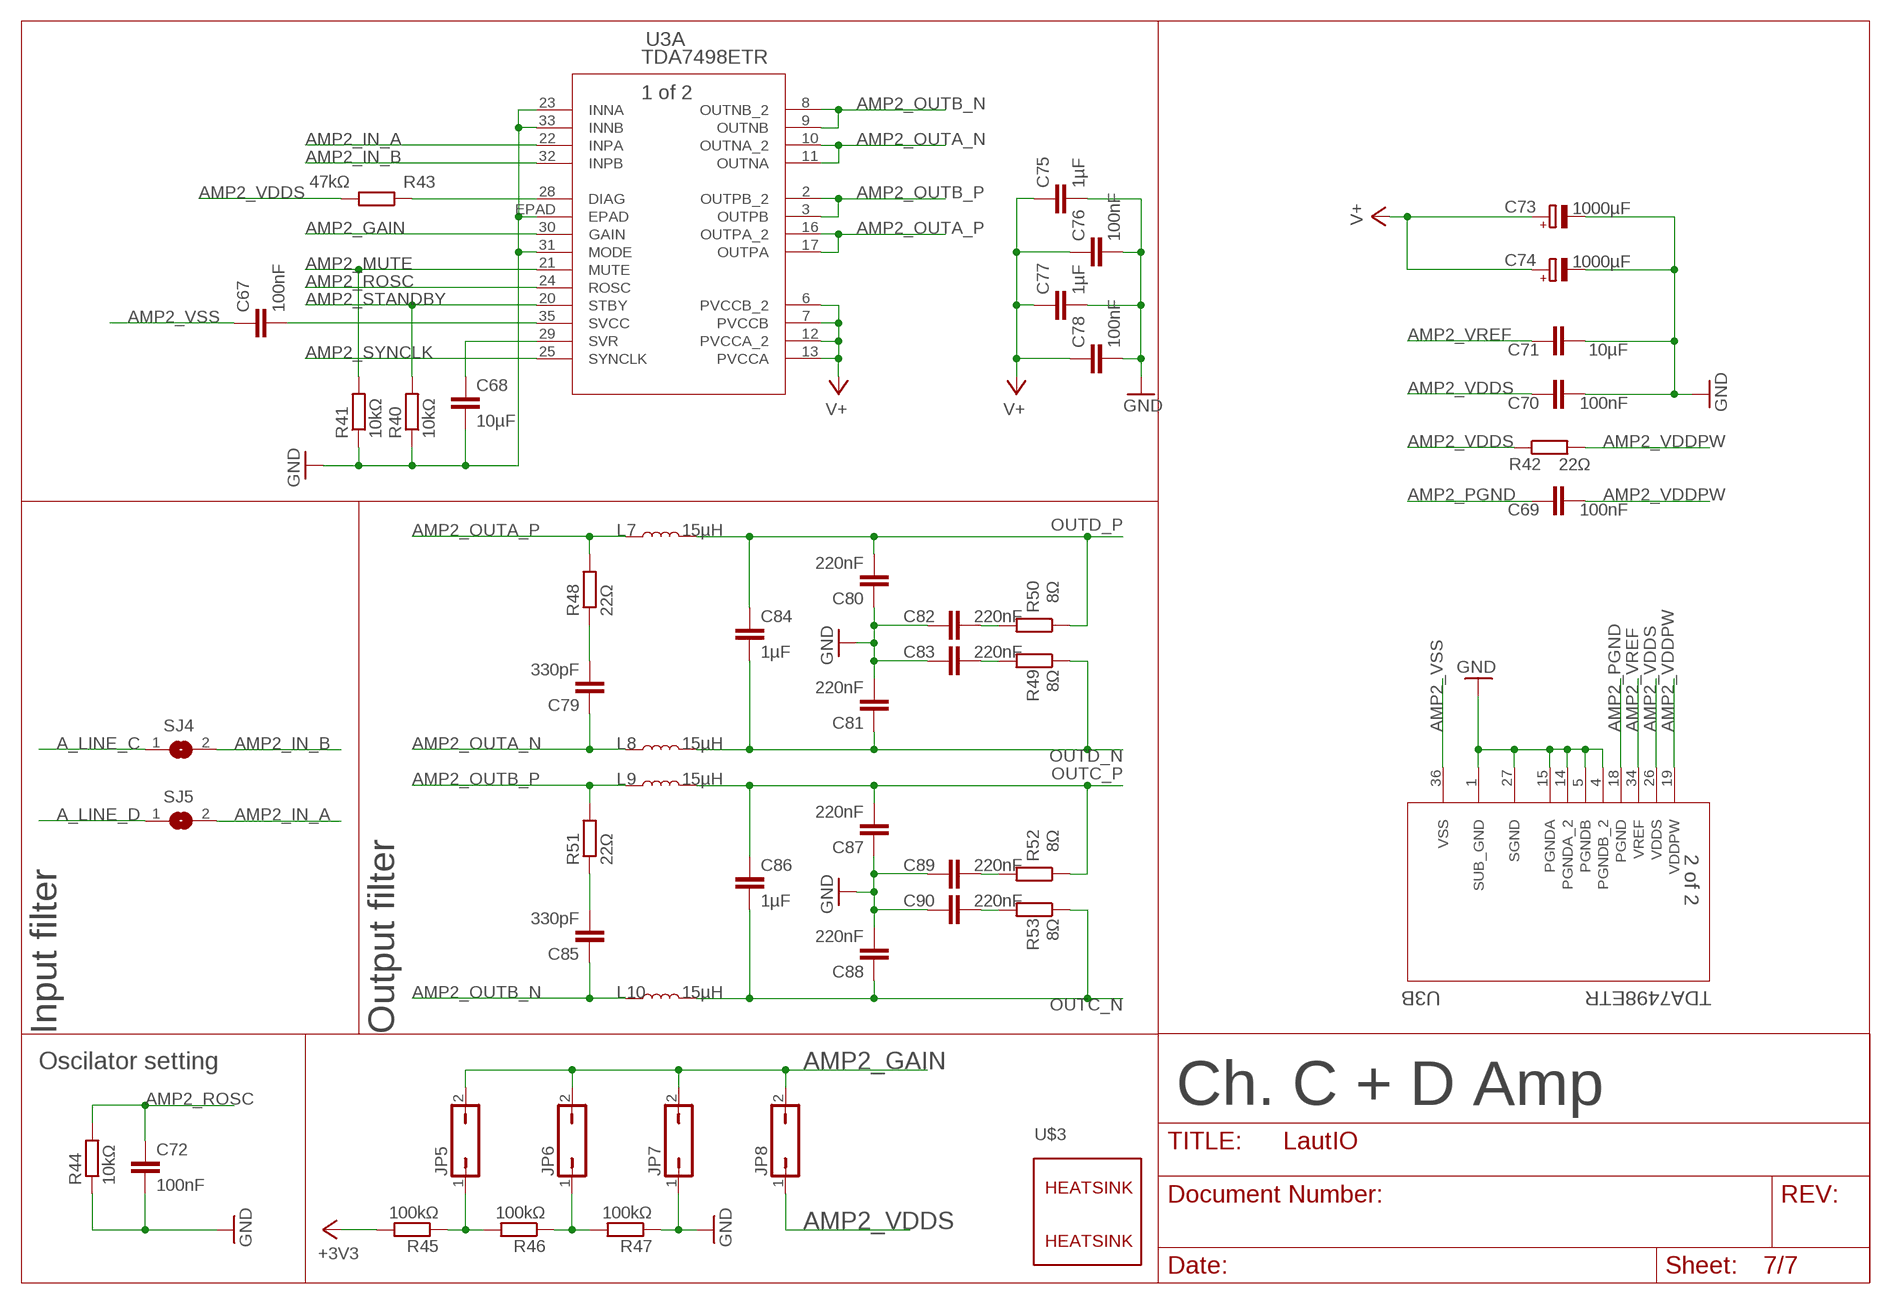
[diagram p6: schematic, sheet 7]

### Parts
C67  100nF  C-EUC0603  [C0603]
C68  10µF  C-EUC1206K  [C1206K]
C69  100nF  C-EUC0603  [C0603]
C70  100nF  C-EUC0603  [C0603]
C71  10µF  C-EUC1206K  [C1206K]
C72  100nF  C-EUC0603  [C0603]
C73  1000µF  CPOL-EUE7.5-16  [E7,5-16]
C74  1000µF  CPOL-EUE7.5-16  [E7,5-16]
C75  1µF  C-EUC0603  [C0603]
C76  100nF  C-EUC0603  [C0603]
C77  1µF  C-EUC0603  [C0603]
C78  100nF  C-EUC0603  [C0603]
C79  330pF  C-EUC0603  [C0603]
C80  220nF  C-EUC0603  [C0603]
C81  220nF  C-EUC0603  [C0603]
C82  220nF  C-EUC0603  [C0603]
C83  220nF  C-EUC0603  [C0603]
C84  1µF  C-EUC3640  [C3640]
C85  330pF  C-EUC0603  [C0603]
C86  1µF  C-EUC3640  [C3640]
C87  220nF  C-EUC0603  [C0603]
C88  220nF  C-EUC0603  [C0603]
C89  220nF  C-EUC0603  [C0603]
C90  220nF  C-EUC0603  [C0603]
JP5  JP1Q  [JP1]
JP6  JP1Q  [JP1]
JP7  JP1Q  [JP1]
JP8  JP1Q  [JP1]
L7  15µH  INDUCTOR-SDR13-27UH  [INDUCTOR_SDR1307]
L8  15µH  INDUCTOR-SDR13-27UH  [INDUCTOR_SDR1307]
L9  15µH  INDUCTOR-SDR13-27UH  [INDUCTOR_SDR1307]
L10  15µH  INDUCTOR-SDR13-27UH  [INDUCTOR_SDR1307]
R40  10kΩ  R-EU_R0603  [R0603]
R41  10kΩ  R-EU_R0603  [R0603]
R42  22Ω  R-EU_R0603  [R0603]
R43  47kΩ  R-EU_R0603  [R0603]
R44  10kΩ  R-EU_R0603  [R0603]
R45  100kΩ  R-EU_R0603  [R0603]
R46  100kΩ  R-EU_R0603  [R0603]
R47  100kΩ  R-EU_R0603  [R0603]
R48  22Ω  R-EU_R0603  [R0603]
R49  8Ω  R-EU_R0603  [R0603]
R50  8Ω  R-EU_R0603  [R0603]
R51  22Ω  R-EU_R0603  [R0603]
R52  8Ω  R-EU_R0603  [R0603]
R53  8Ω  R-EU_R0603  [R0603]
SJ4  SJ  [SJ]
SJ5  SJ  [SJ]
U3  TDA7498ETR  [SSO36_TDA7498ETR_STM]
U$3  ATS-CPX030030030  [ATS-CPX030030030]

### Nets
+3V3: R45.2 ; also sheet 2,3,4,5,6
A_LINE_C: SJ4.1 ; also sheet 5
A_LINE_D: SJ5.1 ; also sheet 5
AMP2_GAIN: JP5.2 JP6.2 JP7.2 JP8.2 U3.30(A:GAIN)
AMP2_IN_A: SJ5.2 U3.22(A:INPA)
AMP2_IN_B: SJ4.2 U3.32(A:INPB)
AMP2_MUTE: R41.2 U3.21(A:MUTE) ; also sheet 4
AMP2_OUTA_N: C79.1 L8.P$1 U3.10(A:OUTNA_2) U3.11(A:OUTNA)
AMP2_OUTA_P: L7.P$1 R48.2 U3.16(A:OUTPA_2) U3.17(A:OUTPA)
AMP2_OUTB_N: C85.1 L10.P$1 U3.8(A:OUTNB_2) U3.9(A:OUTNB)
AMP2_OUTB_P: L9.P$1 R51.2 U3.2(A:OUTPB_2) U3.3(A:OUTPB)
AMP2_PGND: C69.1 U3.18(B:PGND)
AMP2_ROSC: C72.2 R44.2 U3.24(A:ROSC)
AMP2_STANDBY: R40.2 U3.20(A:STBY) ; also sheet 4
AMP2_SYNCLK: U3.25(A:SYNCLK)
AMP2_VDDPW: C69.2 R42.2 U3.19(B:VDDPW)
AMP2_VDDS: C70.1 JP8.1 R42.1 R43.2 U3.26(B:VDDS)
AMP2_VREF: C71.1 U3.34(B:VREF)
AMP2_VSS: C67.1 U3.36(B:VSS)
GND: C68.2 C70.2 C71.2 C72.1 C73.- C74.- C75.2 C76.2 C77.2 C78.2 C80.1 C81.2 C82.2 C83.2 C87.1 C88.2 C89.2 C90.2 JP7.1 R40.1 R41.1 R44.1 R47.1 U3.1(B:SUB_GND) U3.4(B:PGNDB_2) U3.5(B:PGNDB) U3.14(B:PGNDA_2) U3.15(B:PGNDA) U3.23(A:INNA) U3.27(B:SGND) U3.31(A:MODE) U3.33(A:INNB) U3.EPAD(A:EPAD) ; also sheet 2,3,4,5,6
N$34: C67.2 U3.35(A:SVCC)
N$35: C68.1 U3.29(A:SVR)
N$36: R43.1 U3.28(A:DIAG)
N$37: JP5.1 R45.1 R46.2
N$38: JP6.1 R46.1 R47.2
N$39: C79.2 R48.1
N$40: C83.1 R49.2
N$41: C82.1 R50.2
N$42: C85.2 R51.1
N$43: C89.1 R52.2
N$44: C90.1 R53.2
OUTC_N: C86.2 C88.1 L10.P$2 R53.1 ; also sheet 2
OUTC_P: C86.1 C87.2 L9.P$2 R52.1 ; also sheet 2
OUTD_N: C81.1 C84.2 L8.P$2 R49.1 ; also sheet 2
OUTD_P: C80.2 C84.1 L7.P$2 R50.1 ; also sheet 2
V+: C73.+ C74.+ C75.1 C76.1 C77.1 C78.1 U3.6(A:PVCCB_2) U3.7(A:PVCCB) U3.12(A:PVCCA_2) U3.13(A:PVCCA) ; also sheet 2,3,6

### Notes on the sheet
- Input filter | Output filter
- Oscilator setting
- Ch. C + D Amp

## Library data of the parts
C1 C2 C6 C10 C11 C35 C37 C39 C41 C49 C50 C73 C74 = rcl:CPOL-EU: POLARIZED CAPACITOR, European symbol; SPICEPREFIX: C
C3-C5 C7-C9 C12-C34 C36 C38 C40 C42-C48 C51-C72 C75-C90 = rcl:C-EU: CAPACITOR, European symbol; SPICEPREFIX: C
D1 = olelib:STPS20M100SG-TR
ESP = esp32:ESP-WROOM-32: Espressif Systems ESP-WROOM-32
GND VIN = wirepad:SMD5: SMD PAD
IC1 = burr-brown:REG1117: 800mA and 1A Low Dropout (LDO) Positive Regulator 1.8V, 2.5V, 2.85V, 3.3V, 5V, and Adj; MPN: REG1117; OC_FARNELL: 1097566; OC_NEWARK: 14P6981
IO4 IO5 IO14 IO18 IO19 IO23 IO25 IO34 IO35 OUT_A_+ OUT_A_- OUT_B_+ OUT_B_- OUT_C_+ OUT_C_- OUT_D_+ OUT_D_- PAD1-PAD12 = wirepad:SMD2: SMD PAD
J1 J2 = o163744v244+Eagle_WR-USB+(rev20e):614004134726: WR-COM USB 2.0 Type A Up Right Kind Properties Durability:1500 Mating cycles Quality Class:1 500 Mating cycles Connector Type:USB Gender:Receptacle Type:Up Right General Information Operating Temperature:-40up to +105 °C Compliance:RoHS Electrical Properties IR 1:1.5 A Working Voltage:30V (AC) Withstanding Voltage:750V (AC) Contact Resistance:20 mΩ Material Properties Insulator Material:PBT Insulator Flammability Rating:UL94 V-0 Color:White Cover Material:Brass Cover Plating:Nickel Contact Material:Copper Alloy Contact Plating:Selective Gold Contact Type:Stamped Shielding Material:Brass Shielding Plating:Nickel <https://www.we-online.com/catalog/media/o32975v209%20Family_WR-COM_614004134726.jpg> Details see: https://www.we-online.com/catalog/en/COM_TYPE_A_UP_RIGHT Updated by Ella Wu 2020-08-14 2020 (C) Würth Elektronik; APPLICATION: USB 2.0; DATASHEET-URL: https://www.we-online.com/catalog/datasheet/614004134726.pdf; GERDER: Receptacle; INTERFACE-TYPE: Type A; IR1: 1.5A; MOUNT: THT; PACKAGING: Tray; PART-NUMBER: 614004134726; PINS: 4; TYPE: Up Right; WORKING-VOLTAGE: 30V(AC)
J3 J4 = SparkFun-Connectors:CONN_03: Multi connection point. Often used as Generic Header-pin footprint for 0.1 inch spaced/style header connections On any of the 0.1 inch spaced packages, you can populate with these: Break Away Headers - Straight <https://www.sparkfun.com/products/116> (PRT-00116) Break Away Male Headers - Right Angle <https://www.sparkfun.com/products/553> (PRT-00553) Female Headers <https://www.sparkfun.com/products/115> (PRT-00115) Break Away Headers - Machine Pin <https://www.sparkfun.com/products/117> (PRT-00117) Break Away Female Headers - Swiss Machine Pin <https://www.sparkfun.com/products/743> (PRT-00743) Stackable Header - 3 Pin (Female, 0.1") <https://www.sparkfun.com/products/13875> (PRT-13875) For SCREWTERMINALS and SPRING TERMINALS visit here: Screw Terimnals on SparkFun.com <https://www.sparkfun.com/search/results?term=Screw+Terminals> (5mm/3.5mm/2.54mm spacing) This device is also useful as a general connection point to wire up your design to another part of your project. Our various solder wires solder well into these plated through hole pads. Hook-Up Wire - Assortment (Stranded, 22 AWG) <https://www.sparkfun.com/products/11375> (PRT-11375) Hook-Up Wire - Assortment (Solid Core, 22 AWG) <https://www.sparkfun.com/products/11367> (PRT-11367) View the entire wire category on our website here <https://www.sparkfun.com/categories/141> Special notes: Molex polarized connector foot print use with SKU : PRT-08232 with associated crimp pins and housings.; PROD_ID: XXX-00000
J5 = SJ1-3523N:SJ1-3523N: 3.5 mm Right-Angle Stereo Jack, 3 Pin PCB Mount, Non-Threaded; MANUFACTURER: CUI; PARTREV: 1.02; STANDARD: Manufacturer recommendation
J6 = SparkFun-Connectors:CONN_01: Single connection point. Often used as Generic Header-pin footprint for 0.1 inch spaced/style header connections On any of the 0.1 inch spaced packages, you can populate with these: Break Away Headers - Straight <https://www.sparkfun.com/products/116> (PRT-00116) Break Away Male Headers - Right Angle <https://www.sparkfun.com/products/553> (PRT-00553) Female Headers <https://www.sparkfun.com/products/115> (PRT-00115) Break Away Headers - Machine Pin <https://www.sparkfun.com/products/117> (PRT-00117) Break Away Female Headers - Swiss Machine Pin <https://www.sparkfun.com/products/743> (PRT-00743) This device is also useful as a general connection point to wire up your design to another part of your project. Our various solder wires solder well into these plated through hole pads. Hook-Up Wire - Assortment (Stranded, 22 AWG) <https://www.sparkfun.com/products/11375> (PRT-11375) Hook-Up Wire - Assortment (Solid Core, 22 AWG) <https://www.sparkfun.com/products/11367> (PRT-11367) View the entire wire category on our website here <https://www.sparkfun.com/categories/141> Special notes: SMTSO-256-ET is a "flush mount" nut for a 4-40 screw. We mostly use this on specialty testbeds; it is a nice way to connect hardware to your PCB at an adjustable hieght. Also note, the SNAP packages are for using a snappable style connector. We sell a baggie of snaps and they are also used on two LilyPad designs: Snap Assortment - 30 pack (male and female) <https://www.sparkfun.com/products/11347> (DEV-11347) LilyPad Arduino SimpleSnap <https://www.sparkfun.com/products/10941> (DEV-10941) LilyPad SimpleSnap Protoboard <https://www.sparkfun.com/products/10940> (DEV-10940)
J7 = SparkFun-Connectors:CONN_02: Multi connection point. Often used as Generic Header-pin footprint for 0.1 inch spaced/style header connections On any of the 0.1 inch spaced packages, you can populate with these: Break Away Headers - Straight <https://www.sparkfun.com/products/116> (PRT-00116) Break Away Male Headers - Right Angle <https://www.sparkfun.com/products/553> (PRT-00553) Female Headers <https://www.sparkfun.com/products/115> (PRT-00115) Break Away Headers - Machine Pin <https://www.sparkfun.com/products/117> (PRT-00117) Break Away Female Headers - Swiss Machine Pin <https://www.sparkfun.com/products/743> (PRT-00743) For SCREWTERMINALS and SPRING TERMINALS visit here: Screw Terimnals on SparkFun.com <https://www.sparkfun.com/search/results?term=Screw+Terminals> (5mm/3.5mm/2.54mm spacing) This device is also useful as a general connection point to wire up your design to another part of your project. Our various solder wires solder well into these plated through hole pads. Hook-Up Wire - Assortment (Stranded, 22 AWG) <https://www.sparkfun.com/products/11375> (PRT-11375) Hook-Up Wire - Assortment (Solid Core, 22 AWG) <https://www.sparkfun.com/products/11367> (PRT-11367) View the entire wire category on our website here <https://www.sparkfun.com/categories/141> Special notes: Molex polarized connector foot print use with: PRT-08233 with associated crimp pins and housings. 2.54_SCREWTERM for use with PRT-10571. 3.5mm Screw Terminal footprints for PRT-08084 5mm Screw Terminal footprints for use with PRT-08432
JP1-JP8 = jumper:JP1Q: JUMPER
L1 L3-L10 = SparkFun-Coils:INDUCTOR: Inductors Resist changes in electrical current. Basically a coil of wire. SparkFun Products: SparkFun Load Cell Amplifier - HX711 <https://www.sparkfun.com/products/13879> IOIO-OTG - V2.2 <https://www.sparkfun.com/products/13613>; PROD_ID: NDUC-12529; VALUE: 27µH/±20%/3.3A
L2 = SparkFun-Coils:4.7μH_SHIELDED_INDUCTOR: 4.7uH Inductor 4.7uH 1.4A 50mOhm 1008(2520) Package Shielded; PROD_ID: NDUC-15245; VALUE: 4.7μH
Q1 = transistor-pnp:FZT753SMD: PNP Transistor
Q2 = crystal:CSM-7X-DU: SMD CRYSTAL Source: www.ecsxtal.com .. Crystal 3.6864MHz CSM_7X_DU.PDF; OC_FARNELL: unknown; OC_NEWARK: unknown
R1-R8 R13-R53 = rcl:R-EU_: RESISTOR, European symbol; SPICEPREFIX: R
R9-R12 = pot:TRIM_EU-: POTENTIOMETER
REG1 = olelib:TPS54560B-Q1
REG2 = TPS621351RGXR:TPS621351RGXR: Check prices <https://pricing.snapeda.com/parts/TPS621351RGXR/Texas%20Instruments/view-part?ref=eda>; AVAILABILITY: Warning; DESCRIPTION: 3-17V 4.0A Step-Down Converter with 1% accuracy and PFM/Forced-PWM in 2x3QFN 11-VQFN-HR -40 to 125; MF: Texas Instruments; MP: TPS621351RGXR; PACKAGE: VQFN-HR-11 Texas Instruments; PRICE: None; PURCHASE-URL: https://pricing.snapeda.com/search/part/TPS621351RGXR/?ref=eda
S1 S2 = SparkFun-Switches:MOMENTARY-SWITCH-SPST: Momentary Switch (Pushbutton) - SPST Normally-open (NO) SPST momentary switches (buttons, pushbuttons). Variants PTH-12MM - 12mm square, through-hole Momentary Pushbutton Switch - 12mm Square <https://www.sparkfun.com/products/9190> (COM-09190) PTH-6.0MM, PTH-6.0MM-KIT - 6.0mm square, through-hole Mini Pushbutton Switch <https://www.sparkfun.com/products/97> (COM-00097) KIT package intended for soldering kit's - only one side of pads' copper is exposed. PTH-RIGHT-ANGLE-KIT - Right-angle, through-hole Right Angle Tactile Button <https://www.sparkfun.com/products/10791> - Used on SparkFun BigTime Watch Kit <https://www.sparkfun.com/products/11734> SMD-12MM - 12mm square, surface-mount Tactile Button - SMD (12mm) <https://www.sparkfun.com/products/12993> (COM-12993) Used on SparkFun PicoBoard <https://www.sparkfun.com/products/11888> SMD-4.5MM - 4.5mm Square Trackball Switch Used on SparkFun Blackberry Trackballer Breakout <https://www.sparkfun.com/products/13169> SMD-4.6MMX2.8MM - 4.60mm x 2.80mm, surface mount Used on SparkFun SAMD21 Mini Breakout <https://www.sparkfun.com/products/13664> SMD-5.2MM, SMD-5.2-REDUNDANT - 5.2mm square, surface-mount Mini Pushbutton Switch - SMD <https://www.sparkfun.com/products/8720> (COM-08720) Used on Arduino Pro Mini <https://www.sparkfun.com/products/11114> REDUNDANT package connects both switch circuits together SMD-6.0X3.5MM - 6.0 x 3.5mm, surface mount Momentary Reset Switch SMD <https://www.sparkfun.com/products/8229> (COM-08229) SMD-6.2MM-TALL - 6.2mm square, surface mount Tactile Button - SMD (6mm) <https://www.sparkfun.com/products/12992> Used on SparkFun Digital Sandbox <https://www.sparkfun.com/products/12651> SMD-RIGHT-ANGLE - Right-angle, surface mount Used on SparkFun Block for Intel® Edison - Arduino <https://www.sparkfun.com/products/13036>; PROD_ID: SWCH-11966; SF_SKU: COM-12992
SJ1 = jumper:SJ2W: SMD solder JUMPER
SJ2-SJ9 = jumper:SJ: SMD solder JUMPER
U1 = olelib:ADAU1701JSTZ; BUILT_BY: EMA_UL_Team; MANUFACTURER_PART_NUMBER: ADAU1701JSTZ; SOURCELIBRARY: Analog_2015-01-06; VENDOR: Analog Devices Inc
U2 U3 = olelib:TDA7498ETR; BUILT_BY: EMA_Kyle; COPYRIGHT: Copyright (C) 2018 Accelerated Designs. All rights reserved; DATASHEET: https://www.st.com/resource/en/datasheet/tda7498e.pdf; MANUFACTURER_PART_NUMBER: TDA7498ETR; SOURCELIBRARY: Add_to_database_2020-10-27; VENDOR: STMicroelectronics
U$1 = XT60:XT60: XT60
U$2 U$3 = olelib:ATS-CPX030030030
X1 = con-phoenix-508:MKDSN1,5/2-5,08: MKDSN 1,5/ 2-5,08 Printklemme Nennstrom: 13,5 A Nennspannung: 250 V Rastermaß: 5,08 mm Polzahl: 2 Anschlussart: Schraubanschluss Montage: Löten Anschlussrichtung Leiter/Platine: 0 ° Artikelnummer: 1729128 Source: http://eshop.phoenixcontact.com .. 1729128.pdf